# EasyEDA Pro project PocketTerminal_2025-09-03.epro, schematic Schematic1
Board Name: Board1; Create Date: 2025-06-21; Page Name: P1; Project Name: PocketTerminal; Schematic Name: Schematic1; Update Date: 2025-08-27; Company: EasyEDA.com; Page Size: A3; Version: V1.0
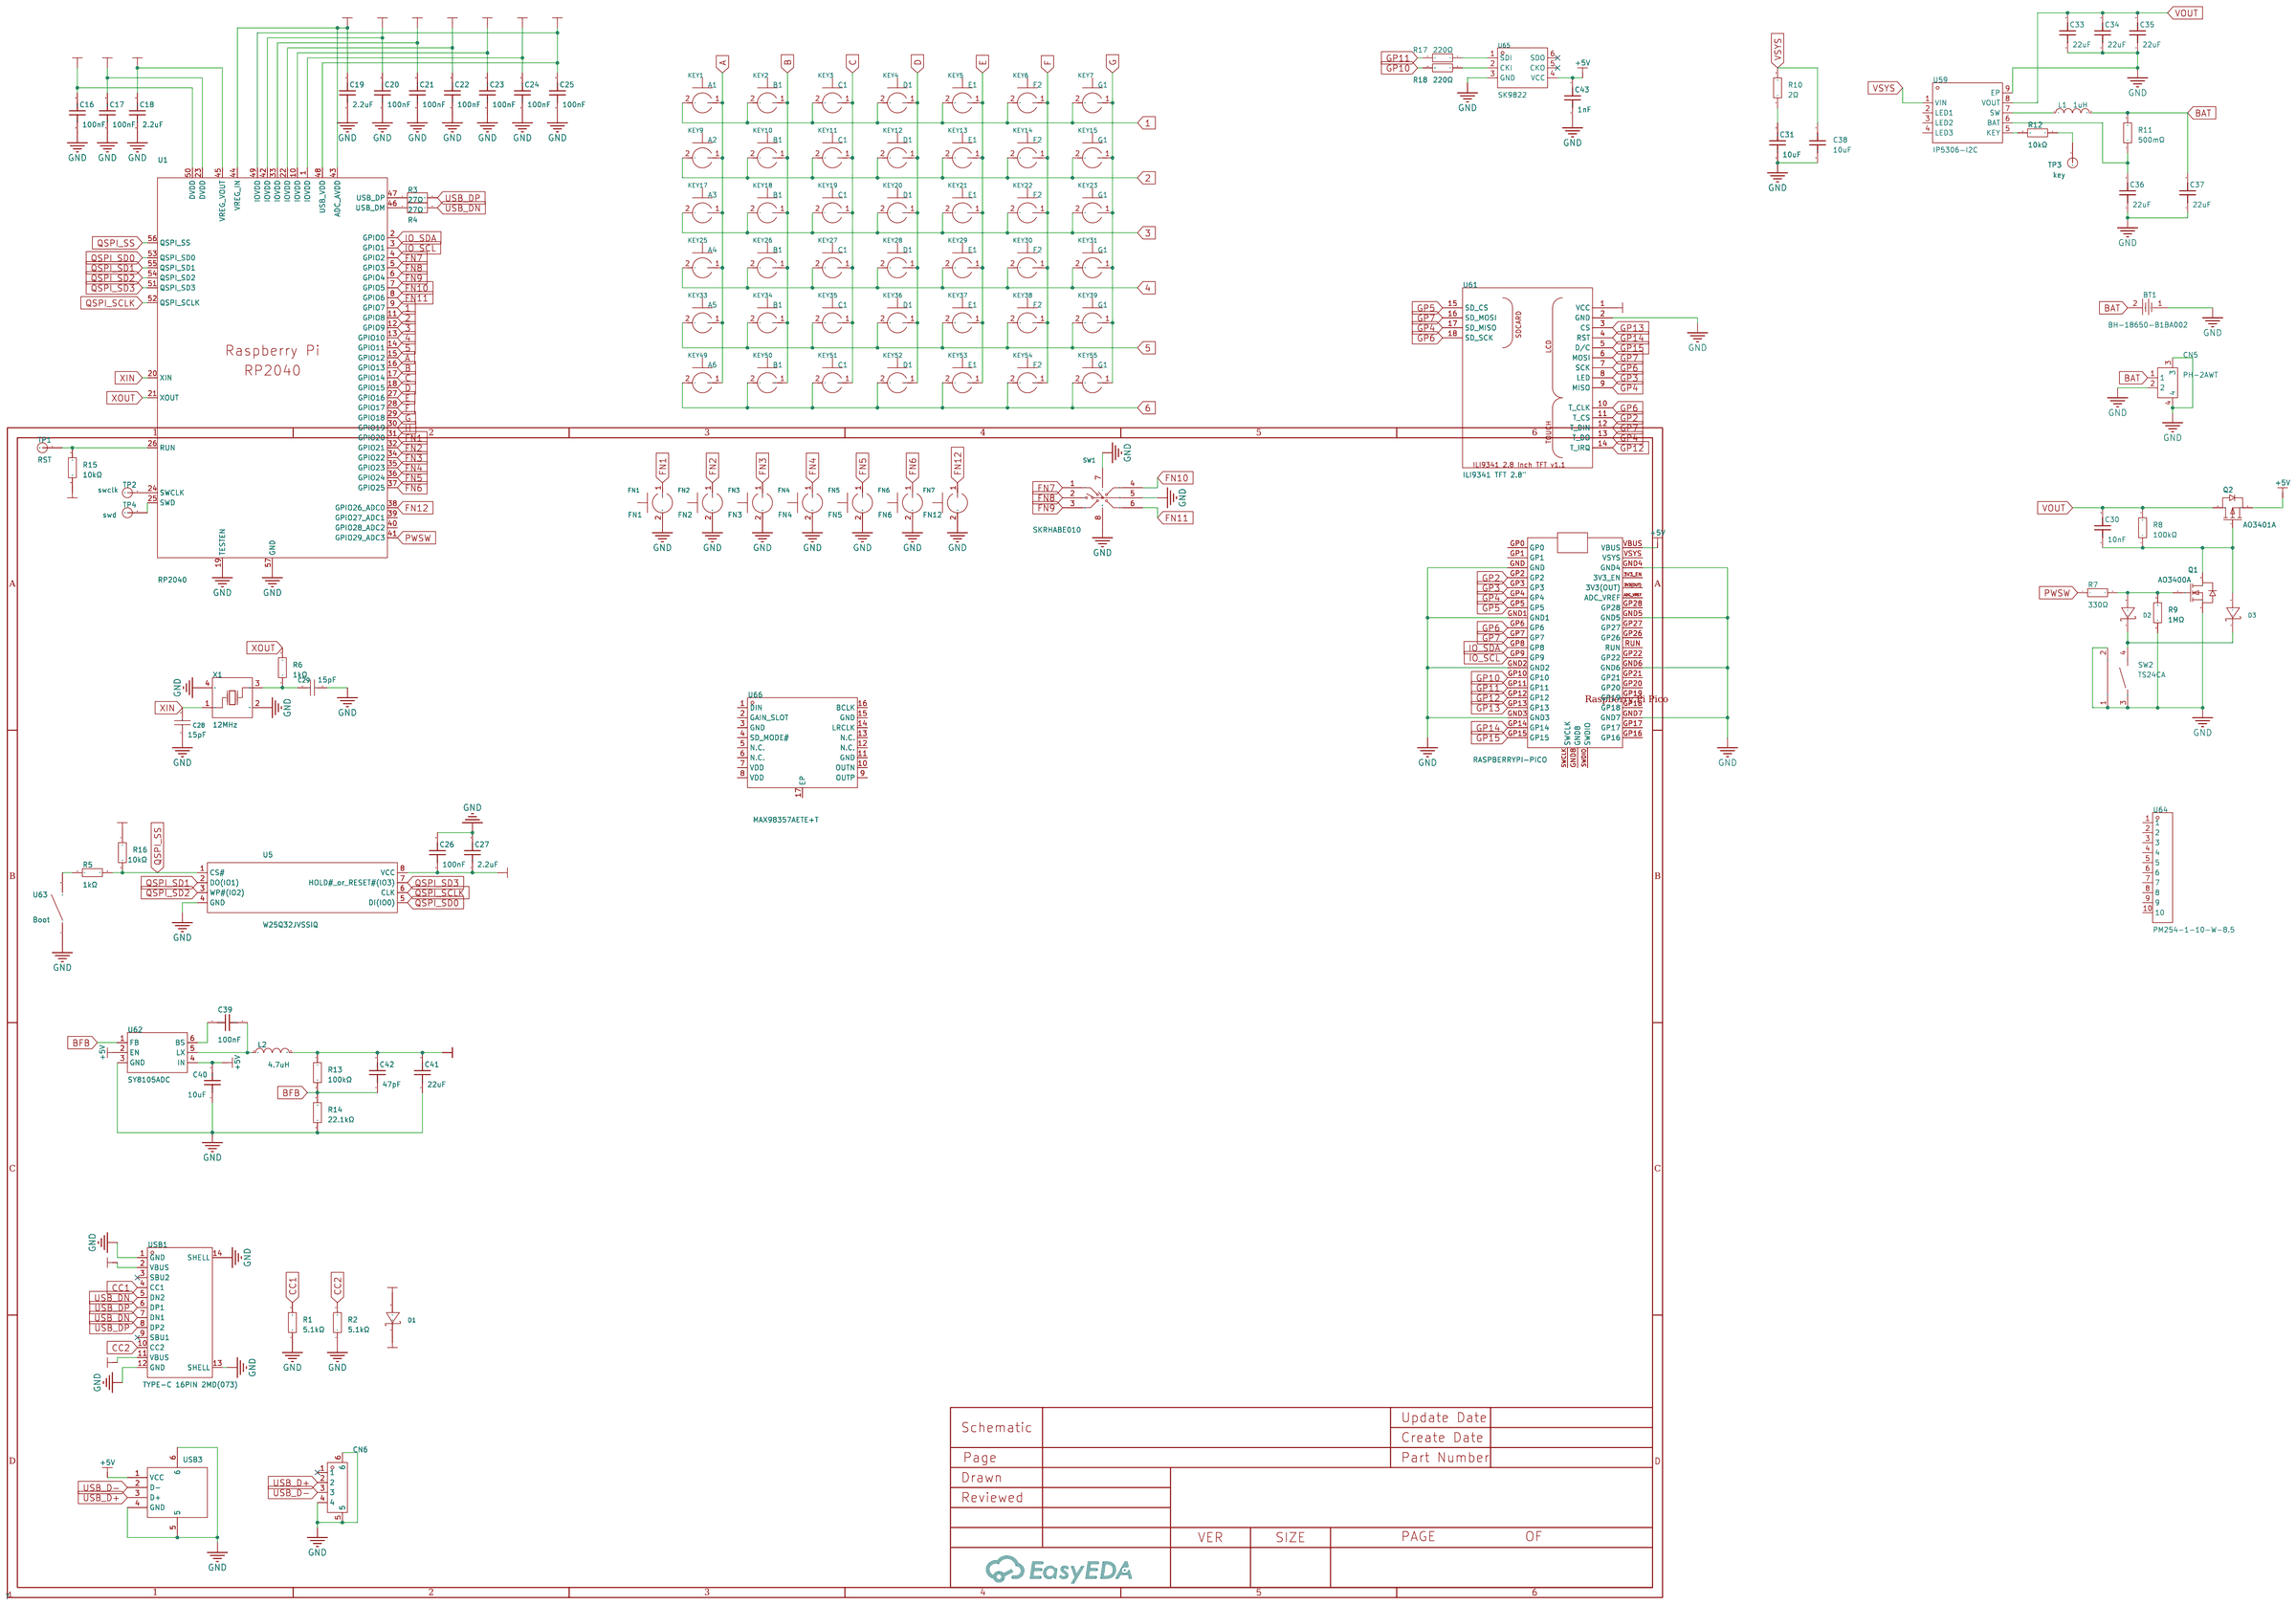
[diagram p0: schematic sheet]

## Parts
2  RASPBERRYPI-PICO  [RASPBERRYPIPICO]
BT1  BH-18650-B1BA002  [BATTERY-SMD_18650-1S-L77.1-W20.7-1]
C16  100nF  [C0603]
C17  100nF  [C0603]
C18  2.2uF  [C0603]
C19  2.2uF  [C0603]
C20  100nF  [C0603]
C21  100nF  [C0603]
C22  100nF  [C0603]
C23  100nF  [C0603]
C24  100nF  [C0603]
C25  100nF  [C0603]
C26  100nF  [C0603]
C27  2.2uF  [C0603]
C28  15pF  [C0603]
C29  15pF  [C0603]
C30  10nF  [C0603]
C31  10uF  [C0603]
C33  22uF  [C0603]
C34  22uF  [C0603]
C35  22uF  [C0603]
C36  22uF  [C0603]
C37  22uF  [C0603]
C38  10uF  [C0603]
C39  100nF  [C0603]
C40  10uF  [C0603]
C41  22uF  [C0603]
C42  47pF  [C0603]
C43  1nF  [C0603]
CN5  PH-2AWT  [CONN-SMD_PH-2AWT]
CN6  533980471  [CONN-SMD_4P-P1.25_533980471]
D1  LMBR120FT1G  [SOD-123_L2.8-W1.8-LS3.7-RD]
D2  LMBR120FT1G  [SOD-123_L2.8-W1.8-LS3.7-RD]
D3  LMBR120FT1G  [SOD-123_L2.8-W1.8-LS3.7-RD]
FN1  FN1  [KEY-SMD_BD5.0_600-508S-180]
FN2  FN2  [KEY-SMD_BD5.0_600-508S-180]
FN3  FN3  [KEY-SMD_BD5.0_600-508S-180]
FN4  FN4  [KEY-SMD_BD5.0_600-508S-180]
FN5  FN5  [KEY-SMD_BD5.0_600-508S-180]
FN6  FN6  [KEY-SMD_BD5.0_600-508S-180]
FN7  FN12  [KEY-SMD_BD5.0_600-508S-180]
KEY1  A1  [KEY-SMD_BD5.0_600-508S-180]
KEY2  B1  [KEY-SMD_BD5.0_600-508S-180]
KEY3  C1  [KEY-SMD_BD5.0_600-508S-180]
KEY4  D1  [KEY-SMD_BD5.0_600-508S-180]
KEY5  E1  [KEY-SMD_BD5.0_600-508S-180]
KEY6  F2  [KEY-SMD_BD5.0_600-508S-180]
KEY7  G1  [KEY-SMD_BD5.0_600-508S-180]
KEY9  A2  [KEY-SMD_BD5.0_600-508S-180]
KEY10  B1  [KEY-SMD_BD5.0_600-508S-180]
KEY11  C1  [KEY-SMD_BD5.0_600-508S-180]
KEY12  D1  [KEY-SMD_BD5.0_600-508S-180]
KEY13  E1  [KEY-SMD_BD5.0_600-508S-180]
KEY14  F2  [KEY-SMD_BD5.0_600-508S-180]
KEY15  G1  [KEY-SMD_BD5.0_600-508S-180]
KEY17  A3  [KEY-SMD_BD5.0_600-508S-180]
KEY18  B1  [KEY-SMD_BD5.0_600-508S-180]
KEY19  C1  [KEY-SMD_BD5.0_600-508S-180]
KEY20  D1  [KEY-SMD_BD5.0_600-508S-180]
KEY21  E1  [KEY-SMD_BD5.0_600-508S-180]
KEY22  F2  [KEY-SMD_BD5.0_600-508S-180]
KEY23  G1  [KEY-SMD_BD5.0_600-508S-180]
KEY25  A4  [KEY-SMD_BD5.0_600-508S-180]
KEY26  B1  [KEY-SMD_BD5.0_600-508S-180]
KEY27  C1  [KEY-SMD_BD5.0_600-508S-180]
KEY28  D1  [KEY-SMD_BD5.0_600-508S-180]
KEY29  E1  [KEY-SMD_BD5.0_600-508S-180]
KEY30  F2  [KEY-SMD_BD5.0_600-508S-180]
KEY31  G1  [KEY-SMD_BD5.0_600-508S-180]
KEY33  A5  [KEY-SMD_BD5.0_600-508S-180]
KEY34  B1  [KEY-SMD_BD5.0_600-508S-180]
KEY35  C1  [KEY-SMD_BD5.0_600-508S-180]
KEY36  D1  [KEY-SMD_BD5.0_600-508S-180]
KEY37  E1  [KEY-SMD_BD5.0_600-508S-180]
KEY38  F2  [KEY-SMD_BD5.0_600-508S-180]
KEY39  G1  [KEY-SMD_BD5.0_600-508S-180]
KEY49  A6  [KEY-SMD_BD5.0_600-508S-180]
KEY50  B1  [KEY-SMD_BD5.0_600-508S-180]
KEY51  C1  [KEY-SMD_BD5.0_600-508S-180]
KEY52  D1  [KEY-SMD_BD5.0_600-508S-180]
KEY53  E1  [KEY-SMD_BD5.0_600-508S-180]
KEY54  F2  [KEY-SMD_BD5.0_600-508S-180]
KEY55  G1  [KEY-SMD_BD5.0_600-508S-180]
L1  1uH  [IND-SMD_L7.0-W6.6]
L2  4.7uH  [IND-SMD_L2.5-W2.0-VLS252012CX-150M]
Q1  AO3400A  [SOT-23-3_L2.9-W1.3-P1.90-LS2.4-BR]
Q2  AO3401A  [SOT-23_L2.9-W1.3-P1.90-LS2.4-BR]
R1  5.1kΩ  [R0603]
R2  5.1kΩ  [R0603]
R3  27Ω  [R0603]
R4  27Ω  [R0603]
R5  1kΩ  [R0603]
R6  1kΩ  [R0603]
R7  330Ω  [R0603]
R8  100kΩ  [R0603]
R9  1MΩ  [R0603]
R10  2Ω  [R0603]
R11  500mΩ  [R0603]
R12  10kΩ  [R0603]
R13  100kΩ  [R0603]
R14  22.1kΩ  [R0603]
R15  10kΩ  [R0603]
R16  10kΩ  [R0603]
R17  220Ω  [R0603]
R18  220Ω  [R0603]
SW1  SKRHABE010  [SW-SMD_SKRHABE010]
SW2  TS24CA  [SW-SMD_TS24CA]
TP1  RST  [TestPoint_1mm]  (no BOM)
TP2  swclk  [TestPoint_1mm]  (no BOM)
TP3  key  [TestPoint_1mm]  (no BOM)
TP4  swd  [TestPoint_1mm]  (no BOM)
U1  RP2040  [QFN-56_L7.0-W7.0-P0.40-TL-EP4.0]
U5  W25Q32JVSSIQ  [SOIC-8_L5.3-W5.3-P1.27-LS8.0-BL]
U59  IP5306-I2C  [ESOP-8_L4.9-W3.9-P1.27-LS6.0-BL-EP2.0]
U61  ILI9341 TFT 2.8"  [ILI9341-2.8]
U62  SY8105ADC  [TSOT-23-6_L2.9-W1.6-P0.95-LS2.8-BR]
U63  Boot  [SW-SMD_L3.9-W3.0-P4.45]
U64  PM254-1-10-W-8.5  [HDR-TH_10P-P2.54-H-F-W10.0-N]
U65  SK9822  [SMD_6P-L5.0-W5.0-TL]
U66  MAX98357AETE+T  [TQFN-16_L3.0-W3.0-P0.50-BL-EP1.5]
USB1  TYPE-C 16PIN 2MD(073)  [USB-C-SMD_TYPE-C-6PIN-2MD-073]
USB3  10.0 QHHTZB6.3  [USB-A-TH_10.0QHHTZB6.3]
X1  12MHz  [CRYSTAL-SMD_4P-L3.2-W2.5-BL]

## Library data of the parts
2 = RASPBERRYPI-PICO: Manufacturer Part: RASPBERRY PI PICO; Supplier: Element14; Supplier Part: 3643332; Manufacturer: Raspberry-PI; link: https://se.farnell.com/b/raspberry-pi
BT1 = BH-18650-B1BA002: Connector Type:Battery box Battery Type:18650; LCSC Part Name: 电池盒 适用电池:18650; Supplier Part: C2988620; Manufacturer: MYOUNG(美阳); Supplier Footprint: SMD; JLCPCB Part Class: Extended Part; Datasheet: https://atta.szlcsc.com/upload/public/pdf/source/20220402/870DB99AB50CA0DF8D51CF7C86A51FAB.pdf; Supplier: LCSC; Connector Type: Battery box; Battery Type: 18650
C16 C17 C20-C26 C39 = CC0603KRX7R9BB104: Capacitance:100nF Tolerance:±10% Tolerance:±10% Voltage Rating:50V Temperature Coefficient:X7R; LCSC Part Name: 100nF ±10% 50V; Supplier Part: C14663; Manufacturer: YAGEO(国巨); Supplier Footprint: 0603; JLCPCB Part Class: Basic Part; Datasheet: https://atta.szlcsc.com/upload/public/pdf/source/20180910/C282072_33301C7F631E79921B82A8DAC6BCC5B3.pdf; Supplier: LCSC; Tolerance: ±10%; Voltage Rating: 50V; Temperature Coefficient: X7R
C18 C19 C27 = CL10A225KO8NNNC: Capacitance: Tolerance:±10% Tolerance:±10% Voltage Rated: Temperature Coefficient:; LCSC Part Name: 2.2uF ±10% 16V; Supplier Part: C23630; Manufacturer: SAMSUNG(三星); Supplier Footprint: 0603; JLCPCB Part Class: Basic Part; Datasheet: https://atta.szlcsc.com/upload/public/pdf/source/20160218/1457707763339.pdf; Supplier: LCSC; Tolerance: ±10%
C28 C29 = CC0603JRNPO9BN150: Capacitance: Tolerance:±5% Tolerance:±5% Voltage Rated: Temperature Coefficient:; LCSC Part Name: 15pF ±5% 50V; Supplier Part: C107037; Manufacturer: YAGEO(国巨); Supplier Footprint: 0603; JLCPCB Part Class: Extended Part; Datasheet: https://atta.szlcsc.com/upload/public/pdf/source/20170914/C128857_1505359892143968080.pdf; Supplier: LCSC; Tolerance: ±5%
C30 = CC0603KRX7R9BB103: Capacitance: Tolerance:±10% Tolerance:±10% Voltage Rated: Temperature Coefficient:; LCSC Part Name: 10nF ±10% 50V; Supplier Part: C100042; Manufacturer: YAGEO(国巨); Supplier Footprint: 0603; JLCPCB Part Class: Extended Part; Datasheet: https://atta.szlcsc.com/upload/public/pdf/source/20181008/C309510_22F155564471FAF6A489F7D68F34234E.pdf; Supplier: LCSC; Tolerance: ±10%
C31 C38 C40 = CL10A106KP8NNNC: Capacitance: Tolerance:±10% Tolerance:±10% Voltage Rated: Temperature Coefficient:; LCSC Part Name: 10uF ±10% 10V; Supplier Part: C19702; Manufacturer: SAMSUNG(三星); Supplier Footprint: 0603; JLCPCB Part Class: Basic Part; Datasheet: https://atta.szlcsc.com/upload/public/pdf/source/20160218/1457707763339.pdf; Supplier: LCSC; Tolerance: ±10%
C33-C37 C41 = CL10A226MP8NUNE: Capacitance: Tolerance:±20% Tolerance:±20% Voltage Rated: Temperature Coefficient:; LCSC Part Name: 22uF ±20% 10V; Supplier Part: C86295; Manufacturer: SAMSUNG(三星); Supplier Footprint: 0603; JLCPCB Part Class: Extended Part; Datasheet: https://atta.szlcsc.com/upload/public/pdf/source/20160218/1457707763339.pdf; Supplier: LCSC; Tolerance: ±20%
C42 = CL10C470JB8NNNC: Capacitance: Tolerance:±5% Tolerance:±5% Voltage Rated: Temperature Coefficient:; LCSC Part Name: 47pF ±5% 50V; Supplier Part: C1671; Manufacturer: SAMSUNG(三星); Supplier Footprint: 0603; JLCPCB Part Class: Basic Part; Datasheet: https://atta.szlcsc.com/upload/public/pdf/source/20160218/1457707763339.pdf; Supplier: LCSC; Tolerance: ±5%
C43 = CL10B102KB8NNNC: Capacitance:1nF Tolerance:±10% Tolerance:±10% Voltage Rating:50V Temperature Coefficient:X7R; LCSC Part Name: 1nF ±10% 50V; Supplier Part: C1588; Manufacturer: SAMSUNG(三星); Supplier Footprint: 0603; JLCPCB Part Class: Basic Part; Datasheet: https://item.szlcsc.com/datasheet/CL10B102KB8NNNC/1940.html; Supplier: LCSC; Tolerance: ±10%; Voltage Rating: 50V; Temperature Coefficient: X7R
CN5 = PH-2AWT: Pins Structure:1x2P Pitch:2mm Mounting Type:Horizontal attachment Reference Series:PH Number of Pins:2P Number of Rows:1 Number of PINs Per Row:2 Current Rating:2A Contact Material:Brass Contact Plating:Tin Operating Temperature:-25℃~+85℃ Operating Temper; LCSC Part Name: 1x2P 间距:2mm 卧贴 系列:PH; Supplier Part: C2763693; Manufacturer: FG(富港); Supplier Footprint: SMD; JLCPCB Part Class: Extended Part; Datasheet: https://atta.szlcsc.com/upload/public/pdf/source/20240627/C0C2BA30B0CAE247E968D481E40E2663.pdf; Supplier: LCSC; Pins Structure: 1x2P; Pitch: 2mm; Mounting Type: Horizontal attachment; Reference Series: PH; Number of Pins: 2P; Number of Rows: 1; Number of PINs Per Row: 2; Current Rating: 2A; Contact Material: Brass; Contact Plating: Tin; Operating Temperature: -25℃~+85℃; Voltage Rating: 250V
CN6 = 533980471_C17617036: Pins Structure:1x4P Pitch:1.25mm Mounting Type:Vertical welding Reference Series:PicoBlade(MX 1.25) Number of Pins:4P Number of Rows:1 Number of PINs Per Row:4 Row Spacing:- Current Rating:1A Contact Material:Phosphor Bronze Contact Plating:Tin Operating; LCSC Part Name: 1x4P 间距:1.25mm 立贴 系列:PicoBlade(MX 1.25); Supplier Part: C17617036; Manufacturer: MOLEX; Supplier Footprint: SMD; JLCPCB Part Class: Extended Part; Datasheet: https://www.molex.com/content/dam/molex/molex-dot-com/products/automated/en-us/salesdrawingpdf/533/53398/533980471_sd.pdf?inline; Supplier: LCSC; Pins Structure: 1x4P; Pitch: 1.25mm; Mounting Type: Vertical welding; Reference Series: PicoBlade(MX 1.25); Number of Pins: 4P; Number of Rows: 1; Number of PINs Per Row: 4; Current Rating: 1A; Contact Material: Phosphor Bronze; Contact Plating: Tin; Operating Temperature: -40℃~+105℃; Voltage Rating: 125V; Plastic Material: Fiberglass Reinforced PA; Flame Retardant Rating: UL94V-0; Supplementary Features: Auxiliary soldering legs; Color: White; Z-Height of the Board: 4.7mm; X-Length of Bottom Edge on Board (Spacing Line): 10.15mm; Y-Width of Bottom Edge on Board: 4.2mm
D1-D3 = LMBR120FT1G: Forward Voltage (Vf@If):500mV Reverse Voltage (Vr):20V Average Rectified Current (Io):1A Reverse Leakage Current (Ir):500uA; LCSC Part Name: 电压:20V 电流:1A; Supplier Part: C81143; Manufacturer: LRC(乐山无线电); Supplier Footprint: SOD-123FL; JLCPCB Part Class: Extended Part; Datasheet: https://atta.szlcsc.com/upload/public/pdf/source/20180403/C189873_AF31CC9C061CE27ABB35F054435B675C.pdf; Supplier: LCSC; Forward Voltage (Vf@If): 500mV; Reverse Voltage (Vr): 20V; Average Rectified Current (Io): 1A; Reverse Leakage Current (Ir): 500uA
FN1-FN7 KEY1-KEY7 KEY9-KEY15 KEY17-KEY23 KEY25-KEY31 KEY33-KEY39 KEY50-KEY55 = 603-528S-080: Features:Circular Metal Size:φ5mm Height:0.25mm Travel:0.25mm Switching Life:100万次 Operating Force:80gf Operating Temperature:-40℃~+90℃ Operating Temperature:-40℃~+90℃; Supplier Part: C256272; Manufacturer: HYP(鸿源精密); JLCPCB Part Class: Extended Part; Datasheet: https://atta.szlcsc.com/upload/public/pdf/source/20180725/C260954_317398C97146CD414E5620879D254F2B.pdf; Supplier: LCSC; Features: Circular; Metal Size: φ5mm; Height: 0.25mm; Travel: 0.25mm; Switching Life: 100万次; Operating Force: 80gf; Operating Temperature: -40℃~+90℃
KEY49 = 603-528S-055: Features:Circular Metal Size:φ5mm Height:0.25mm Travel:0.25mm Switching Life:1 million times Operating Force:55gf Operating Temperature:-40℃~+90℃ Operating Temperature:-40℃~+90℃; Supplier Part: C256266; Manufacturer: HYP(鸿源精密); JLCPCB Part Class: Extended Part; Datasheet: https://atta.szlcsc.com/upload/public/pdf/source/20180725/C260954_317398C97146CD414E5620879D254F2B.pdf; Supplier: LCSC; Features: Circular; Metal Size: φ5mm; Height: 0.25mm; Travel: 0.25mm; Switching Life: 1 million times; Operating Force: 55gf; Operating Temperature: -40℃~+90℃
L1 = FXL0630-1R0-M: Inductance: Tolerance:±20% Tolerance:±20% Rated Current: Saturation Current (Isat):15A DC Resistance (DCR): Type:Integrated molded inductor; LCSC Part Name: 1uH ±20% 15A; Supplier Part: C167216; Manufacturer: cjiang(长江微电); Supplier Footprint: SMD,6.6x7mm; JLCPCB Part Class: Extended Part; Datasheet: https://atta.szlcsc.com/upload/public/pdf/source/20240426/3189EA8206330E2108542F9E34E540E7.pdf; Supplier: LCSC; Tolerance: ±20%; Saturation Current (Isat): 15A; Type: Integrated molded inductor
L2 = FTC252010S4R7MBCA: Inductance: Tolerance:±20% Tolerance:±20% Rated Current:2A Saturation Current (Isat):2.6A DC Resistance (DCR): Type:一体成型电感; LCSC Part Name: 4.7uH ±20% 2.6A; Supplier Part: C5832360; Manufacturer: cjiang(长江微电); Supplier Footprint: SMD,2x2.5mm; JLCPCB Part Class: Extended Part; Datasheet: https://atta.szlcsc.com/upload/public/pdf/source/20230602/8FFEDA9C0247A92A0D4B67554BFE4091.pdf; Supplier: LCSC; Tolerance: ±20%; Rated Current: 2A; Saturation Current (Isat): 2.6A; Type: 一体成型电感
Q1 = AO3400A_C20917: Type:1 N-Channel Drain Source Voltage (Vdss): Continuous Drain Current (Id): Drain Source On Resistance (RDS(on)@Vgs,Id):26.5mΩ@10V,5.7A Power Dissipation (Pd): Gate Threshold Voltage (Vgs(th)@Id):1.5V@250uA Total Gate Charge (Qg@Vgs):7nC@4.5V Input Capac; LCSC Part Name: 1个N沟道 耐压:30V 电流:5.7A; Supplier Part: C20917; Manufacturer: AOS; Supplier Footprint: SOT-23-3L; JLCPCB Part Class: Basic Part; Datasheet: https://atta.szlcsc.com/upload/public/pdf/source/20140107/1457706668533.pdf; Supplier: LCSC; Type: 1 N-Channel; Drain Source On Resistance (RDS(on)@Vgs,Id): 26.5mΩ@10V,5.7A; Gate Threshold Voltage (Vgs(th)@Id): 1.5V@250uA; Total Gate Charge (Qg@Vgs): 7nC@4.5V; Input Capacitance (Ciss@Vds): 630pF@15V; Operating Temperature: -55℃~+150℃@(Tj)
Q2 = AO3401A_C347476: Type:1 Piece P-Channel Drain Source Voltage (Vdss): Continuous Drain Current (Id): Drain Source On Resistance (RDS(on)@Vgs,Id):50mΩ@10V Power Dissipation (Pd): Gate Threshold Voltage (Vgs(th)@Id):400mV@250uA Total Gate Charge (Qg@Vgs):9.4nC@4.5V Input Cap; LCSC Part Name: 1个P沟道 耐压:30V 电流:4.2A; Supplier Part: C347476; Manufacturer: UMW(友台半导体); Supplier Footprint: SOT-23; JLCPCB Part Class: Extended Part; Datasheet: https://atta.szlcsc.com/upload/public/pdf/source/20231109/42F312EBB081D72F04A7E8221BFFAF9D.pdf; Supplier: LCSC; Type: 1 Piece P-Channel; Drain Source On Resistance (RDS(on)@Vgs,Id): 50mΩ@10V; Gate Threshold Voltage (Vgs(th)@Id): 400mV@250uA; Total Gate Charge (Qg@Vgs): 9.4nC@4.5V; Input Capacitance (Ciss@Vds): 954pF; Reverse Transfer Capacitance (Crss@Vds): 77pF; Operating Temperature: -55℃~+150℃
R1 R2 = FRC0603F5101TS: Type:Thick Film Resistors Resistance:5.1kΩ Tolerance:±1% Tolerance:±1% Power(Watts): Overload Voltage (Max): Temperature Coefficient:±100ppm/℃ Temperature Coefficient:±100ppm/℃ Operating Temperature Range:-55℃~+155℃ Operating Temperature Range:-55℃~+155℃; LCSC Part Name: 5.1kΩ ±1% 100mW 厚膜电阻; Supplier Part: C2907044; Manufacturer: FOJAN(富捷); Supplier Footprint: 0603; JLCPCB Part Class: Extended Part; Datasheet: https://atta.szlcsc.com/upload/public/pdf/source/20211221/925EC7D7225764EE0046F22065062C87.pdf; Supplier: LCSC; Type: Thick Film Resistors; Tolerance: ±1%; Temperature Coefficient: ±100ppm/℃; Operating Temperature Range: -55℃~+155℃
R3 R4 = FRC0603F27R0TS: Type:Thick Film Resistors Resistance:27Ω Tolerance:±1% Tolerance:±1% Power(Watts):0.1W Voltage-Supply(Max):75V Temperature Coefficient:±100ppm/℃ Temperature Coefficient:±100ppm/℃ Operating Temperature:-55℃~+155℃ Operating Temperature:-55℃~+155℃; LCSC Part Name: 27Ω ±1% 100mW 厚膜电阻; Supplier Part: C2907021; Manufacturer: FOJAN(富捷); Supplier Footprint: 0603; JLCPCB Part Class: Extended Part; Datasheet: https://atta.szlcsc.com/upload/public/pdf/source/20211221/925EC7D7225764EE0046F22065062C87.pdf; Supplier: LCSC; Type: Thick Film Resistors; Tolerance: ±1%; Power(Watts): 0.1W; Voltage-Supply(Max): 75V; Temperature Coefficient: ±100ppm/℃; Operating Temperature: -55℃~+155℃
R5 R6 = RC0603FR-071KL: Type:Thick Film Resistors Resistance:1kΩ Tolerance:±1% Tolerance:±1% Power(Watts):100mW Voltage-Supply(Max):75V Temperature Coefficient:±100ppm/℃ Temperature Coefficient:±100ppm/℃ Operating Temperature:-55℃~+155℃ Operating Temperature:-55℃~+155℃; LCSC Part Name: 厚膜电阻 1kΩ ±1% 100mW; Supplier Part: C22548; Manufacturer: YAGEO(国巨); Supplier Footprint: 0603; JLCPCB Part Class: Extended Part; Datasheet: https://atta.szlcsc.com/upload/public/pdf/source/20180316/70C0E2BDAE7FCC62C531A5A58D202EE1.pdf; Supplier: LCSC; Type: Thick Film Resistors; Tolerance: ±1%; Power(Watts): 100mW; Voltage-Supply(Max): 75V; Temperature Coefficient: ±100ppm/℃; Operating Temperature: -55℃~+155℃
R7 = RC0603FR-07330RL: Type:Thick Film Resistors Resistance: Tolerance:±1% Tolerance:±1% Power(Watts): Overload Voltage (Max): Temperature Coefficient:±100ppm/℃ Temperature Coefficient:±100ppm/℃ Operating Temperature Range:-55℃~+155℃ Operating Temperature Range:-55℃~+155℃; LCSC Part Name: 厚膜电阻 330Ω ±1% 100mW; Supplier Part: C105881; Manufacturer: YAGEO(国巨); Supplier Footprint: 0603; JLCPCB Part Class: Extended Part; Datasheet: https://atta.szlcsc.com/upload/public/pdf/source/20180821/C275644_0D56F95EFF785E7D9A1FEF436B37DA78.pdf; Supplier: LCSC; Type: Thick Film Resistors; Tolerance: ±1%; Temperature Coefficient: ±100ppm/℃; Operating Temperature Range: -55℃~+155℃
R8 R12 R15 R16 = RC0603FR-07100KL: Type:Thick Film Resistors Resistance: Tolerance:±1% Tolerance:±1% Power(Watts): Overload Voltage (Max): Temperature Coefficient:±100ppm/℃ Temperature Coefficient:±100ppm/℃ Operating Temperature Range:-55℃~+155℃ Operating Temperature Range:-55℃~+155℃; LCSC Part Name: 厚膜电阻 100kΩ ±1% 100mW; Supplier Part: C14675; Manufacturer: YAGEO(国巨); Supplier Footprint: 0603; JLCPCB Part Class: Extended Part; Datasheet: https://atta.szlcsc.com/upload/public/pdf/source/20140324/1457707028752.pdf; Supplier: LCSC; Type: Thick Film Resistors; Tolerance: ±1%; Temperature Coefficient: ±100ppm/℃; Operating Temperature Range: -55℃~+155℃
R9 = RC0603FR-071ML: Type:Thick Film Resistors Resistance: Tolerance:±1% Tolerance:±1% Power(Watts): Overload Voltage (Max): Temperature Coefficient:±100ppm/℃ Temperature Coefficient:±100ppm/℃ Operating Temperature Range:-55℃~+155℃ Operating Temperature Range:-55℃~+155℃; LCSC Part Name: 厚膜电阻 1MΩ ±1% 100mW; Supplier Part: C105578; Manufacturer: YAGEO(国巨); Supplier Footprint: 0603; JLCPCB Part Class: Extended Part; Datasheet: https://atta.szlcsc.com/upload/public/pdf/source/20181102/C105578_67A9388250AF143DE4682E62257D2969.pdf; Supplier: LCSC; Type: Thick Film Resistors; Tolerance: ±1%; Temperature Coefficient: ±100ppm/℃; Operating Temperature Range: -55℃~+155℃
R10 R17 R18 = FRC0603J2R0 TS: Type:Thick Film Resistors Resistance: Tolerance:±5% Tolerance:±5% Power(Watts): Overload Voltage (Max): Temperature Coefficient:±200ppm/℃ Temperature Coefficient:±200ppm/℃ Operating Temperature Range:-55℃~+155℃ Operating Temperature Range:-55℃~+155℃; LCSC Part Name: 2Ω ±5% 100mW 厚膜电阻; Supplier Part: C2907139; Manufacturer: FOJAN(富捷); Supplier Footprint: 0603; JLCPCB Part Class: Extended Part; Datasheet: https://atta.szlcsc.com/upload/public/pdf/source/20211221/925EC7D7225764EE0046F22065062C87.pdf; Supplier: LCSC; Type: Thick Film Resistors; Tolerance: ±5%; Temperature Coefficient: ±200ppm/℃; Operating Temperature Range: -55℃~+155℃
R11 = FRL0603JR500TS: Type:Thick Film Resistors Resistance: Tolerance:±5% Tolerance:±5% Power(Watts): Overload Voltage (Max): Temperature Coefficient:±300ppm/℃ Temperature Coefficient:±300ppm/℃ Operating Temperature Range:-55℃~+155℃ Operating Temperature Range:-55℃~+155℃; LCSC Part Name: 500mΩ ±5% 100mW 厚膜电阻; Supplier Part: C2930046; Manufacturer: FOJAN(富捷); Supplier Footprint: 0603; JLCPCB Part Class: Extended Part; Datasheet: https://atta.szlcsc.com/upload/public/pdf/source/20211221/925EC7D7225764EE0046F22065062C87.pdf; Supplier: LCSC; Type: Thick Film Resistors; Tolerance: ±5%; Temperature Coefficient: ±300ppm/℃; Operating Temperature Range: -55℃~+155℃
R13 = FCR0603F100K: Type:Thick Film Resistors Resistance: Tolerance:±1% Tolerance:±1% Power(Watts): Overload Voltage (Max): Operating Temperature Range:-55℃~+155℃ Operating Temperature Range:-55℃~+155℃; LCSC Part Name: 100K ±1%; Supplier Part: C5913165; Manufacturer: VO(翔胜); Supplier Footprint: 0603; JLCPCB Part Class: Extended Part; Datasheet: https://atta.szlcsc.com/upload/public/pdf/source/20230428/98B65D379E9BA4CF2A9223D1647B01B6.pdf; Supplier: LCSC; Type: Thick Film Resistors; Tolerance: ±1%; Operating Temperature Range: -55℃~+155℃
R14 = RC0603FR-0722K1L: Type:Thick Film Resistors Resistance: Tolerance:±1% Tolerance:±1% Power(Watts): Overload Voltage (Max): Temperature Coefficient:±100ppm/℃ Temperature Coefficient:±100ppm/℃ Operating Temperature Range:-55℃~+155℃ Operating Temperature Range:-55℃~+155℃; LCSC Part Name: 厚膜电阻 22.1kΩ ±1% 100mW; Supplier Part: C137768; Manufacturer: YAGEO(国巨); Supplier Footprint: 0603; JLCPCB Part Class: Extended Part; Datasheet: https://atta.szlcsc.com/upload/public/pdf/source/20180821/C275644_0D56F95EFF785E7D9A1FEF436B37DA78.pdf; Supplier: LCSC; Type: Thick Film Resistors; Tolerance: ±1%; Temperature Coefficient: ±100ppm/℃; Operating Temperature Range: -55℃~+155℃
SW1 = SKRHABE010: Supplier Part: C139794; Manufacturer: ALPSALPINE(阿尔卑斯阿尔派); Supplier Footprint: SMD-8P,7.5x7.5mm; JLCPCB Part Class: Extended Part; Datasheet: https://atta.szlcsc.com/upload/public/pdf/source/20171113/C139794_15105612668951115728.pdf; Supplier: LCSC
SW2 = TS24CA: Circuit:SPST Actuator Style:Rectangular Button Mounting Type:Surface Mount, Right Angle Length:4.55mm Width:1.8mm Switch Height:3.5mm Contact Current:50mA Voltage Rating:12V With Lamp:- Life:-; LCSC Part Name: 4.55*1.8*3.5mm 卧贴 轻触开关; Supplier Part: C393942; Manufacturer: SHOU HAN(首韩); Supplier Footprint: SMD; JLCPCB Part Class: Extended Part; Datasheet: https://atta.szlcsc.com/upload/public/pdf/source/20240424/43D93777DD1504A9F6E2A772ABCDC7B4.pdf; Supplier: LCSC; Circuit: SPST; Actuator Style: Rectangular Button; Mounting Type: Surface Mount, Right Angle; Length: 4.55mm; Width: 1.8mm; Switch Height: 3.5mm; Contact Current: 50mA; Voltage Rating: 12V
TP1-TP4 = TestPoint
U1 = RP2040: Supplier Part: C2961140; Manufacturer: Raspberry Pi(树莓派); Supplier Footprint: QFN-56-EP(7x7); JLCPCB Part Class: Extended Part; Datasheet: https://atta.szlcsc.com/upload/public/pdf/source/20220208/8D54DD1C91A7987165C42A5C4D6BB336.pdf; Supplier: LCSC
U5 = W25Q32JVSSIQ: Interface:SPI Memory Size:32Mbit Clock Frequency:133MHz Voltage - Supply:2.7V~3.6V Voltage - Supply:2.7V~3.6V Standby Supply Current:1uA Program / Erase Cycles:100,000 Cycles Page Programming Time (Tpp):3ms Block Erase Time(tBE):- Data Retention - TDR (Ye; Supplier Part: C179173; Manufacturer: Winbond(华邦); Supplier Footprint: SOIC-8-208mil; JLCPCB Part Class: Extended Part; Datasheet: https://atta.szlcsc.com/upload/public/pdf/source/20191218/C179173_5BBD793D2D7B3672E140BC7AE85C11FF.pdf; Supplier: LCSC; Interface: SPI; Memory Size: 32Mbit; Clock Frequency: 133MHz; Voltage - Supply: 2.7V~3.6V; Standby Supply Current: 1uA; Program / Erase Cycles: 100,000 Cycles; Page Programming Time (Tpp): 3ms; Data Retention - TDR (Year): 20 Years; Operating Temperature: -40℃~+85℃
U59 = IP5306-I2C: Supplier Part: C488349; Manufacturer: INJOINIC(英集芯); Supplier Footprint: ESOP-8; JLCPCB Part Class: Extended Part; Datasheet: https://atta.szlcsc.com/upload/public/pdf/source/20231017/AB6A25E64E1038420E9A7039637542A8.pdf; Supplier: LCSC
U61 = ILI9341 TFT 2.8": Supplier Part: ILI9341; Supplier: Amazon; Manufacturer Part: ILI9341
U62 = SY8105ADC: Function:Step-down type Output Type:- Voltage - Supply:4.5V~18V Voltage - Supply:4.5V~18V Output Voltage:1.2V~3.3V Output Voltage:1.2V~3.3V Output Current:5A Frequency - Switching:500kHz Frequency - Switching:500kHz Operating Temperature:-40℃~+125℃@(TJ) O; LCSC Part Name: 高效500kHz 5A 18V输入同步降压DC-DC转换器; Supplier Part: C178247; Manufacturer: silergy(矽力杰); Supplier Footprint: TSOT-23-6; JLCPCB Part Class: Extended Part; Datasheet: https://atta.szlcsc.com/upload/public/pdf/source/20180327/C178247_4D08D20890F19046BD0FAAFAD21320D4.pdf; Supplier: LCSC; Function: Step-down type; Voltage - Supply: 4.5V~18V; Output Voltage: 1.2V~3.3V; Output Current: 5A; Frequency - Switching: 500kHz; Operating Temperature: -40℃~+125℃@(TJ); Synchronous Rectifier: Yes; Number of Outputs: 1; Topology: Step-down; Switch tube (built-in/external): Built-in
U63 = TS-1088R-02026: Circuit:SPST Actuator Style:Round Button Mounting Style:Brick nogging Switch Length:3.9mm Switch Width:2.93mm Switch Height:2mm Contact Current:50mA Voltage Rating (DC):12V With Lamp:- Mechanical Life:-; LCSC Part Name: 3.9*2.93*2mm 立贴 轻触开关; Supplier Part: C455280; Manufacturer: XUNPU(讯普); Supplier Footprint: SMD,3x4mm; JLCPCB Part Class: Extended Part; Datasheet: https://atta.szlcsc.com/upload/public/pdf/source/20191118/C455281_EC5379764BC1462550DF64BBBFEA9579.pdf; Supplier: LCSC; Circuit: SPST; Actuator Style: Round Button; Mounting Style: Brick nogging; Switch Length: 3.9mm; Switch Width: 2.93mm; Switch Height: 2mm; Contact Current: 50mA; Voltage Rating (DC): 12V
U64 = PM254-1-10-W-8.5: Holes Structure:1x10P Pitch:2.54mm Row Spacing:- Circular Hole / Square Hole:Square Holes Mounting Type:Right-Angle Number of Rows:Plugin Number of Holes:10P Current Rating (Max):3A Voltage Rating (Max):- Holes Direction:side Insulation Height:8.5mm Conta; LCSC Part Name: 1x10P 间距:2.54mm 弯插; Supplier Part: C2897392; Manufacturer: HCTL(华灿天禄); Supplier Footprint: 弯插,P=2.54mm; JLCPCB Part Class: Extended Part; Datasheet: https://atta.szlcsc.com/upload/public/pdf/source/20230609/7BA40A3D721268A082DCDEAD4C99131B.pdf; Supplier: LCSC; Holes Structure: 1x10P; Pitch: 2.54mm; Circular Hole / Square Hole: Square Holes; Mounting Type: Right-Angle; Number of Rows: Plugin; Number of Holes: 10P; Current Rating (Max): 3A; Holes Direction: side; Insulation Height: 8.5mm; Contact Material: Copper Alloy; Operating Temperature Range: -40℃~+105℃; Soldering Temperature(Max): 260℃@5S
U65 = SK9822: Type:- Voltage - Input(DC):- Voltage - Input(DC):- Frequency - Switching:30MHz Frequency - Switching:30MHz Number of Channels:2 Output Voltage:- Output Voltage:- Output Current:20mA Dimming:PWM Features:- Topology:- Operating temperature:-20℃~+80℃ Operati; LCSC Part Name: PWM调光; Supplier Part: C2829089; Manufacturer: 欧思科光电; Supplier Footprint: SMD-6P,5.5x5mm; JLCPCB Part Class: Extended Part; Datasheet: https://item.szlcsc.com/datasheet/SK9822/2978092.html; Supplier: LCSC; Frequency - Switching: 30MHz; Number of Channels: 2; Output Current: 20mA; Dimming: PWM; Operating temperature: -20℃~+80℃
U66 = MAX98357AETE+T: Class:- Speaker Channels:- Output Power:- Voltage - Supply:2.5V~5.5V Voltage - Supply:2.5V~5.5V Total Harmonic Distortion + Noise (THD+N):- Quiescent Current:- Operating Temperature:-40℃~+85℃ Operating Temperature:-40℃~+85℃; LCSC Part Name: 微型、低成本、PCM 类 D 级放大器具有 AB 级性能; Supplier Part: C910544; Manufacturer: ADI(亚德诺)/MAXIM(美信); Supplier Footprint: TQFN-16-EP(3x3); JLCPCB Part Class: Extended Part; Datasheet: https://atta.szlcsc.com/upload/public/pdf/source/20210106/C910544_CB6DE4B2CEE254A72E6BDB40E718D281.pdf; Supplier: LCSC; Voltage - Supply: 2.5V~5.5V; Operating Temperature: -40℃~+85℃
USB1 = TYPE-C 16PIN 2MD(073): Connector Type:Type-C Protocol Standard:USB 3.1 Gender:Female Mounting Type:Surface Mount, Right Angle Number of Contacts:16P Number of Ports:1 Current Rating-Power:3A Voltage Rating:5V Connect-Disconnect Life:5,000 Cycles Supplementary Features:- Center; LCSC Part Name: Type-C 母 卧贴; Supplier Part: C2765186; Manufacturer: SHOU HAN(首韩); Supplier Footprint: SMD; JLCPCB Part Class: Extended Part; Datasheet: https://item.szlcsc.com/datasheet/TYPE-C%252016PIN%25202MD(073)/2901843.html; Supplier: LCSC; Connector Type: Type-C; Protocol Standard: USB 3.1; Gender: Female; Mounting Type: Surface Mount, Right Angle; Number of Contacts: 16P; Number of Ports: 1; Current Rating-Power: 3A; Voltage Rating: 5V; Connect-Disconnect Life: 5,000 Cycles; Detection color: Black; Operating Temperature: -25℃~+85℃
USB3 = 10.0 QHHTZB6.3: Connector Type:Type-A Protocol Standard:USB 2.0 Gender:Female Mounting Type:Surface Mount, Right Angle Number of Contacts:4P Number of Ports:1 Current Rating-Power:1.5A Voltage Rating:30V Connect-Disconnect Life:5,000 Cycles Supplementary Features:- Cente; LCSC Part Name: Type-A 母 卧贴; Supplier Part: C668591; Manufacturer: SHOU HAN(首韩); Supplier Footprint: SMD; JLCPCB Part Class: Extended Part; Datasheet: https://atta.szlcsc.com/upload/public/pdf/source/20200618/C668591_4974797655F912CB13E5351AD3DDB1B7.pdf; Supplier: LCSC; Connector Type: Type-A; Protocol Standard: USB 2.0; Gender: Female; Mounting Type: Surface Mount, Right Angle; Number of Contacts: 4P; Number of Ports: 1; Current Rating-Power: 1.5A; Voltage Rating: 30V; Connect-Disconnect Life: 5,000 Cycles; Length: 10mm; Detection color: Black; Operating Temperature: -25℃~+85℃
X1 = TAXM12M4RFBCCT2T: Type:Surface Mount Crystal Frequency:12MHz Normal temperature Frequency Tolerance:±10ppm Normal temperature Frequency Tolerance:±10ppm Load Capacitance: Frequency Stability:±50ppm Frequency Stability:±50ppm Equivalent Series Resistance(ESR):80Ω Operating; LCSC Part Name: 12MHz ±10ppm 12pF; Supplier Part: C133337; Manufacturer: YJX(雅晶鑫); Supplier Footprint: SMD3225-4P; JLCPCB Part Class: Extended Part; Datasheet: https://atta.szlcsc.com/upload/public/pdf/source/20171014/C133337_15079754979871038234.pdf; Supplier: LCSC; Type: Surface Mount Crystal; Normal temperature Frequency Tolerance: ±10ppm; Frequency Stability: ±50ppm; Equivalent Series Resistance(ESR): 80Ω; Operating Temperature: -40℃~+85℃

## Nets
+1.1V: C16.2 C17.2 C18.2 U1.23(DVDD) U1.45(VREG_VOUT) U1.50(DVDD)
+3V3: C19.2 C20.2 C21.2 C22.2 C23.2 C24.2 C25.2 C26.1 C27.1 C41.2 C42.2 L2.2 R13.1 R15.2 R16.1 U1.1(IOVDD) U1.10(IOVDD) U1.22(IOVDD) U1.33(IOVDD) U1.42(IOVDD) U1.43(ADC_AVDD) U1.44(VREG_IN) U1.48(USB_VDD) U1.49(IOVDD) U5.8(VCC) U61.1(VCC)
+5V: 2.VBUS C40.2 C43.2 Q2.2(S) U62.2(EN) U62.4(IN) U65.4(VCC) USB3.1(VCC)
GND: 2.GND 2.GND1 2.GND2 2.GND3 2.GND4 2.GND5 2.GND6 2.GND7 BT1.1 C16.1 C17.1 C18.1 C19.1 C20.1 C21.1 C22.1 C23.1 C24.1 C25.1 C26.2 C27.2 C28.1 C29.1 C31.1 C33.1 C34.1 C35.1 C36.1 C37.1 C38.2 C40.1 C41.1 C43.1 CN5.2 CN5.3 CN5.4 CN6.4 CN6.5 CN6.6 FN1.2 FN2.2 FN3.2 FN4.2 FN5.2 FN6.2 FN7.2 Q1.2(S) R1.1 R2.1 R9.1 R14.1 SW1.5(COM) SW1.7 SW1.8 SW2.1 SW2.2 SW2.3 U1.19(TESTEN) U1.57(GND) U5.4(GND) U59.9(EP) U61.2(GND) U62.3(GND) U63.1 U65.3(GND) USB1.1(GND) USB1.12(GND) USB1.13(SHELL) USB1.14(SHELL) USB3.4(GND) USB3.5 USB3.6 X1.2(GND) X1.4(GND)
VBUS: D1.2(A) USB1.2(VBUS) USB1.11(VBUS)
1: KEY1.2 KEY2.2 KEY3.2 KEY4.2 KEY5.2 KEY6.2 KEY7.2 U1.9(GPIO7)
2: KEY9.2 KEY10.2 KEY11.2 KEY12.2 KEY13.2 KEY14.2 KEY15.2 U1.11(GPIO8)
3: KEY17.2 KEY18.2 KEY19.2 KEY20.2 KEY21.2 KEY22.2 KEY23.2 U1.12(GPIO9)
4: KEY25.2 KEY26.2 KEY27.2 KEY28.2 KEY29.2 KEY30.2 KEY31.2 U1.13(GPIO10)
5: KEY33.2 KEY34.2 KEY35.2 KEY36.2 KEY37.2 KEY38.2 KEY39.2 U1.14(GPIO11)
6: KEY49.2 KEY50.2 KEY51.2 KEY52.2 KEY53.2 KEY54.2 KEY55.2
A: KEY1.1 KEY9.1 KEY17.1 KEY25.1 KEY33.1 KEY49.1 U1.15(GPIO12)
B: KEY2.1 KEY10.1 KEY18.1 KEY26.1 KEY34.1 KEY50.1 U1.16(GPIO13)
BAT: BT1.2 C37.2 CN5.1 L1.2 R11.2
BFB: C42.1 R13.2 R14.2 U62.1(FB)
C: KEY3.1 KEY11.1 KEY19.1 KEY27.1 KEY35.1 KEY51.1 U1.17(GPIO14)
CC1: R1.2 USB1.4(CC1)
CC2: R2.2 USB1.10(CC2)
D: KEY4.1 KEY12.1 KEY20.1 KEY28.1 KEY36.1 KEY52.1 U1.18(GPIO15)
E: KEY5.1 KEY13.1 KEY21.1 KEY29.1 KEY37.1 KEY53.1 U1.27(GPIO16)
F: KEY6.1 KEY14.1 KEY22.1 KEY30.1 KEY38.1 KEY54.1 U1.28(GPIO17)
FN1: FN1.1 U1.31(GPIO20)
FN2: FN2.1 U1.32(GPIO21)
FN3: FN3.1 U1.34(GPIO22)
FN4: FN4.1 U1.35(GPIO23)
FN5: FN5.1 U1.36(GPIO24)
FN6: FN6.1 U1.37(GPIO25)
FN7: SW1.1(A) U1.4(GPIO2)
FN8: SW1.2(CEN) U1.5(GPIO3)
FN9: SW1.3(C) U1.6(GPIO4)
FN10: SW1.4(D) U1.7(GPIO5)
FN11: SW1.6(B) U1.8(GPIO6)
FN12: FN7.1 U1.38(GPIO26_ADC0)
G: KEY7.1 KEY15.1 KEY23.1 KEY31.1 KEY39.1 KEY55.1 U1.29(GPIO18)
GP2: 2.GP2 U61.11(T_CS)
GP3: 2.GP3 U61.8(LED)
GP4: 2.GP4 U61.9(MISO) U61.13(T_DO) U61.17(SD_MISO)
GP5: 2.GP5 U61.15(SD_CS)
GP6: 2.GP6 U61.7(SCK) U61.10(T_CLK) U61.18(SD_SCK)
GP7: 2.GP7 U61.6(MOSI) U61.12(T_DIN) U61.16(SD_MOSI)
GP10: 2.GP10 R18.2
GP11: 2.GP11 R17.2
GP12: 2.GP12 U61.14(T_IRQ)
GP13: 2.GP13 U61.3(CS)
GP14: 2.GP14 U61.4(RST)
GP15: 2.GP15 U61.5(D/C)
H: U1.30(GPIO19)
IO_SCL: 2.GP9 U1.3(GPIO1)
IO_SDA: 2.GP8 U1.2(GPIO0)
PWSW: R7.1 U1.41(GPIO29_ADC3)
QSPI_SCLK: U1.52(QSPI_SCLK) U5.6(CLK)
QSPI_SD0: U1.53(QSPI_SD0) U5.5(DI(IO0))
QSPI_SD1: U1.55(QSPI_SD1) U5.2(DO(IO1))
QSPI_SD2: U1.54(QSPI_SD2) U5.3(WP#(IO2))
QSPI_SD3: U1.51(QSPI_SD3) U5.7(HOLD# or RESET#(IO3))
QSPI_SS: R5.2 R16.2 U1.56(QSPI_SS) U5.1(CS#)
USB_D+: CN6.2 USB3.3(D+)
USB_D-: CN6.3 USB3.2(D-)
USB_DN: R4.2 USB1.5(DN2) USB1.7(DN1)
USB_DP: R3.2 USB1.6(DP1) USB1.8(DP2)
VOUT: C30.2 C33.2 C34.2 C35.2 Q2.3(D) R8.2 U59.8(VOUT)
VSYS: C38.1 D1.1(K) R10.2 U59.1(VIN)
XIN: C28.2 U1.20(XIN) X1.1(OSC1)
XOUT: R6.2 U1.21(XOUT)
$1N3931: R3.1 U1.47(USB_DP)
$1N3933: R4.1 U1.46(USB_DM)
$1N4882: C29.2 R6.1 X1.3(OSC2)
$1N5030: R5.1 U63.2
$1N5098: R15.1 TP1.1 U1.26(RUN)
$1N34793: C31.2 R10.1
$1N35302: C36.2 R11.1 U59.6(BAT)
$1N35309: L1.1 U59.7(SW)
$1N35479: R12.2 U59.5(KEY)
$1N35483: R12.1 TP3.1
$1N35763: C30.1 D3.2(A) Q1.3(D) Q2.1(G) R8.1
$1N35788: D2.2(A) Q1.1(G) R7.2 R9.2
$1N40183: D2.1(K) D3.1(K) SW2.4
$1N52045: C39.2 L2.1 U62.5(LX)
$1N52049: C39.1 U62.6(BS)
$1N56161: TP4.1 U1.25(SWD)
$1N63771: TP2.1 U1.24(SWCLK)
$1N84009: R17.1 U65.1(SDI)
$1N84052: R18.1 U65.2(CKI)

Not connected (* = marked no-connect by the designer): 2 3V3(OUT) 3V3_EN ADC_VREF GND8 GP0 GP1 GP16 GP17 GP18 GP19 GP20 GP21 GP22 GP26 GP27 GP28 RUN SWCLK SWDIO VSYS; CN6 1*; U1 39(GPIO27_ADC1) 40(GPIO28_ADC2); U59 2(LED1) 3(LED2) 4(LED3); U64 1 2 3 4 5 6 7 8 9 10; U65 5(CKO)* 6(SDO)*; U66 1(DIN) 2(GAIN_SLOT) 3(GND) 4(SD_MODE#) 5(N.C.) 6(N.C.) 7(VDD) 8(VDD) 9(OUTP) 10(OUTN) 11(GND) 12(N.C.) 13(N.C.) 14(LRCLK) 15(GND) 16(BCLK) 17(EP); USB1 3(SBU2)* 9(SBU1)*
